# EAGLE schematic 513_lora_raspberrypi_ES920 (EAGLE 9.6.2)
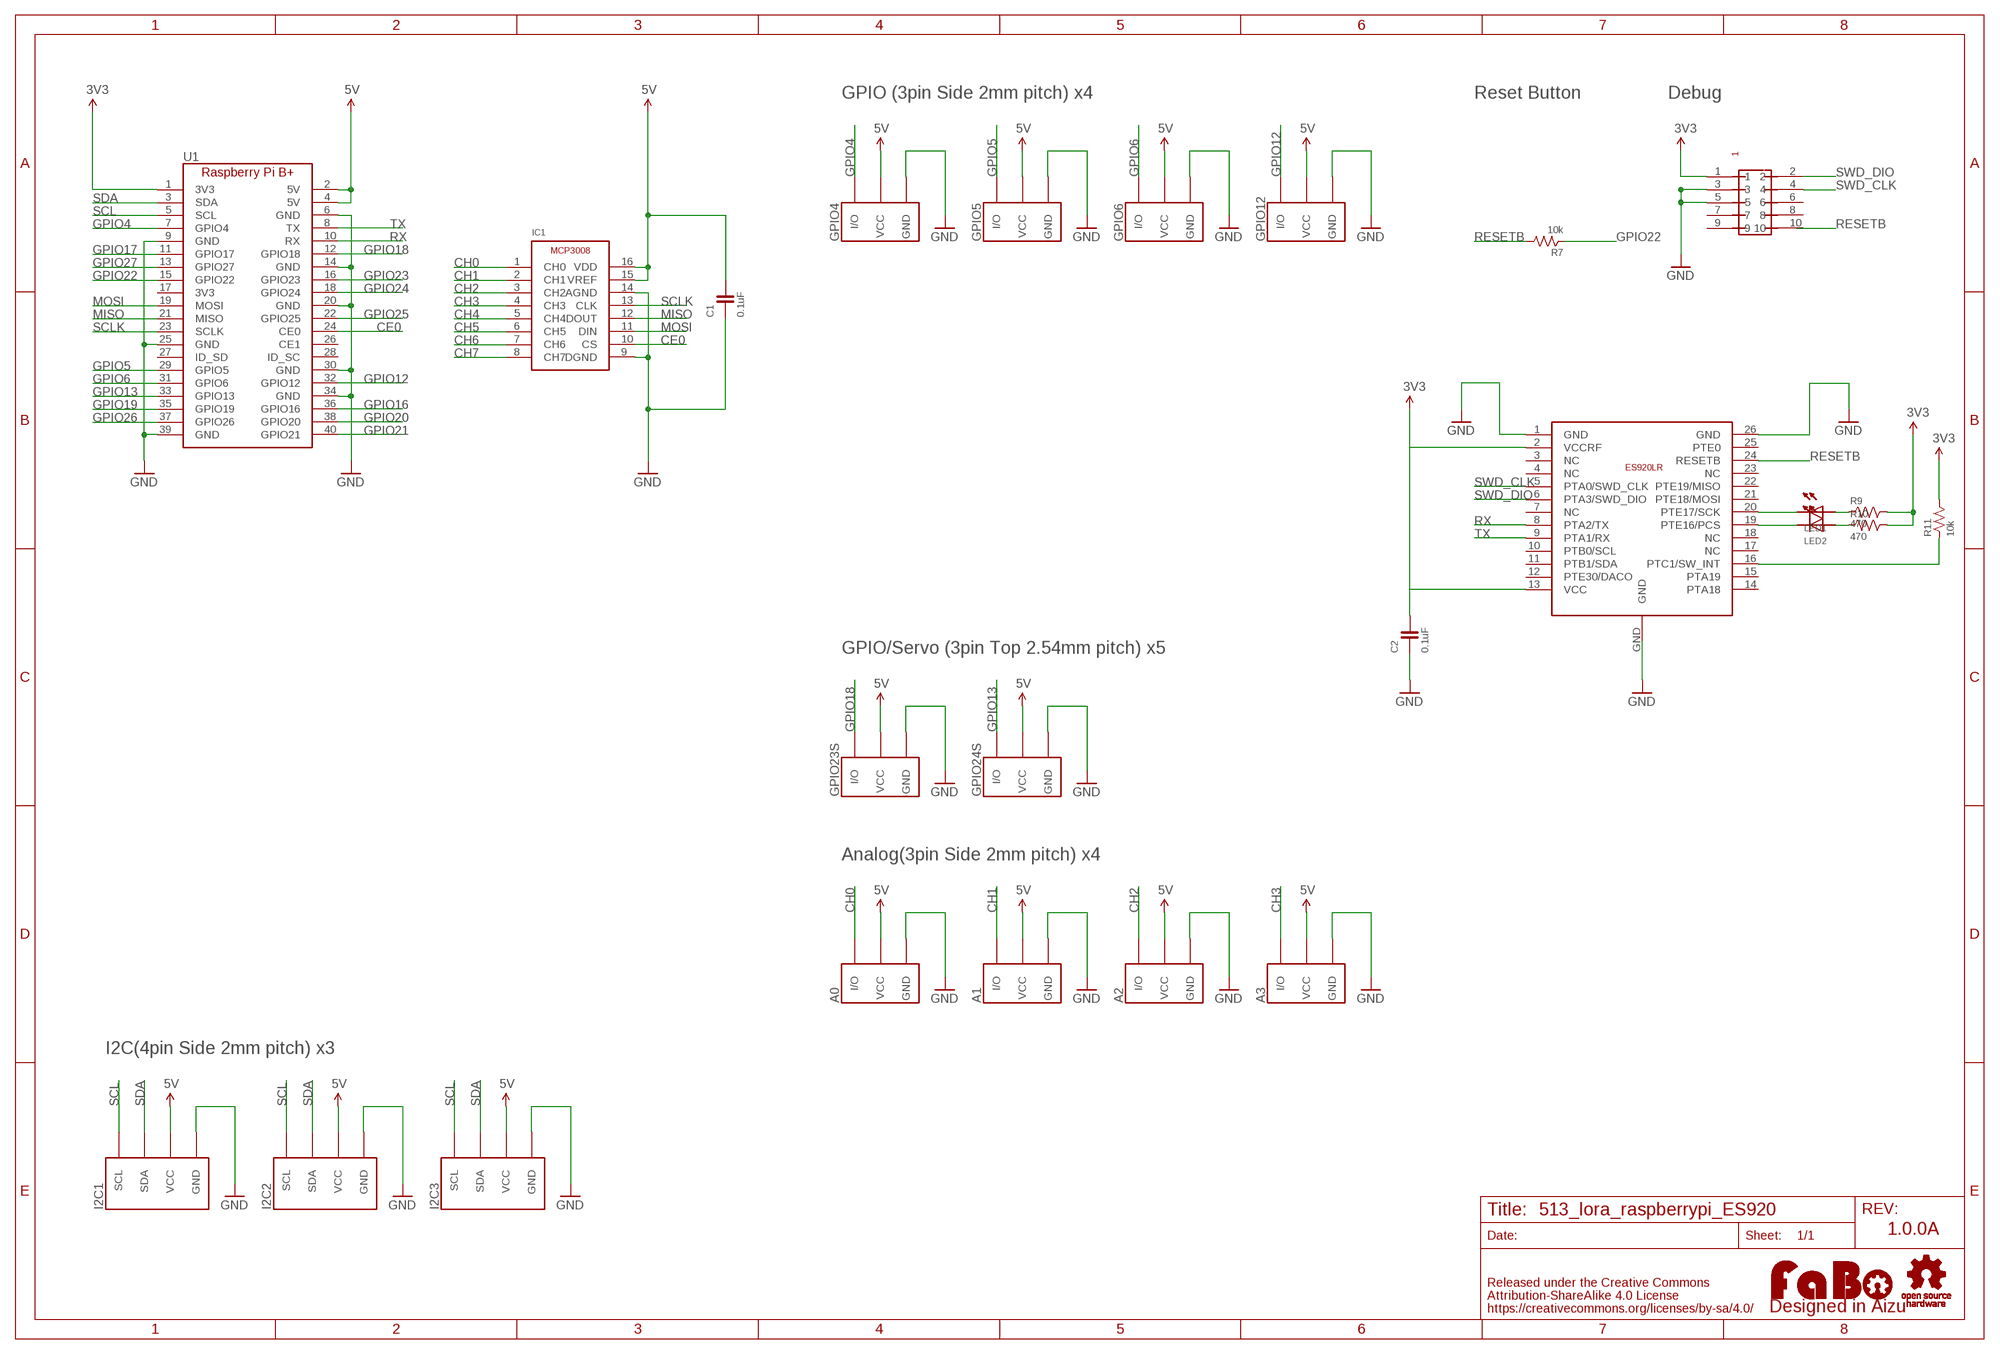
[diagram p0: schematic, sheet 1]

## Parts
A0  FABO_BRICK_3PIN-B03B-PASK-1  [FABO_BRICK_3PIN_B03B-PASK-1]
A1  FABO_BRICK_3PIN-B03B-PASK-1  [FABO_BRICK_3PIN_B03B-PASK-1]
A2  FABO_BRICK_3PIN-B03B-PASK-1  [FABO_BRICK_3PIN_B03B-PASK-1]
A3  FABO_BRICK_3PIN-B03B-PASK-1  [FABO_BRICK_3PIN_B03B-PASK-1]
C1  0.1uF  CAPACITOR-0603  [0603]
C2  0.1uF  CAPACITOR-0603_NARROW  [0603-NARROW]
GPIO4  FABO_BRICK_3PIN-S03B-PASK-2  [FABO_BRICK_3PIN_S03B-PASK-2]
GPIO5  FABO_BRICK_3PIN-S03B-PASK-2  [FABO_BRICK_3PIN_S03B-PASK-2]
GPIO6  FABO_BRICK_3PIN-S03B-PASK-2  [FABO_BRICK_3PIN_S03B-PASK-2]
GPIO12  FABO_BRICK_3PIN-S03B-PASK-2  [FABO_BRICK_3PIN_S03B-PASK-2]
GPIO23S  FABO_BRICK_3PIN-HEADER  [FABO_BRICK_3PIN_HEADER]
GPIO24S  FABO_BRICK_3PIN-HEADER  [FABO_BRICK_3PIN_HEADER]
I2C1  FABO_BRICK_I2C-S04B-PASK-2  [FABO_BRICK_I2C_S04B-PASK-2]
I2C2  FABO_BRICK_I2C-S04B-PASK-2  [FABO_BRICK_I2C_S04B-PASK-2]
I2C3  FABO_BRICK_I2C-S04B-PASK-2  [FABO_BRICK_I2C_S04B-PASK-2]
IC1  MICROCHIP-MCP3008  [MICROCHIP-MCP3008]
LED1  LED-0603  [0603]
LED2  LED-0603  [0603]
LOGO1  LOGO_FABO-M  [LOGO_FABO_M]
R7  10k  RESISTOR-0603-NARROW  [0603-NARROW]
R9  470  RESISTOR-0603-NARROW  [0603-NARROW]
R10  470  RESISTOR-0603-NARROW  [0603-NARROW]
R11  10k  RESISTOR-0603-NARROW  [0603-NARROW]
U1  RASPBERRY_PI_B+  [RASPBERRY_PI_B+]
U$3  LOGO_OSHW-M_BOTTOM  [LOGO_OSHW_M_BOTTOM]
U$15  PIN-HEADER-SMT(1.27MM)2X5  [PIN-HEADER-SMT(1.27MM)2X5]
U$16  ES920LR  [ES920LR]

## Nets
3V3: C2.2 R9.2 R10.2 R11.2 U1.1(3V3) U$15.1 U$16.2(VCCRF) U$16.13(VCC)
5V: A0.VCC A1.VCC A2.VCC A3.VCC C1.2 GPIO4.VCC GPIO5.VCC GPIO6.VCC GPIO12.VCC GPIO23S.VCC GPIO24S.VCC I2C1.VCC I2C2.VCC I2C3.VCC IC1.15(VREF) IC1.16(VDD) U1.2(5V) U1.4(5V)
CE0: IC1.10(CS) U1.24(CE0)
CH0: A0.I/O IC1.1(CH0)
CH1: A1.I/O IC1.2(CH1)
CH2: A2.I/O IC1.3(CH2)
CH3: A3.I/O IC1.4(CH3)
CH4: IC1.5(CH4)
CH5: IC1.6(CH5)
CH6: IC1.7(CH6)
CH7: IC1.8(CH7)
GND: A0.GND A1.GND A2.GND A3.GND C1.1 C2.1 GPIO4.GND GPIO5.GND GPIO6.GND GPIO12.GND GPIO23S.GND GPIO24S.GND I2C1.GND I2C2.GND I2C3.GND IC1.9(DGND) IC1.14(AGND) U1.6(GND) U1.9(GND) U1.14(GND) U1.20(GND) U1.25(GND) U1.30(GND) U1.34(GND) U1.39(GND) U$15.3 U$15.5 U$16.1(GND) U$16.26(GND) U$16.GND
GPIO4: GPIO4.I/O U1.7(GPIO4)
GPIO5: GPIO5.I/O U1.29(GPIO5)
GPIO6: GPIO6.I/O U1.31(GPIO6)
GPIO12: GPIO12.I/O U1.32(GPIO12)
GPIO13: GPIO24S.I/O U1.33(GPIO13)
GPIO16: U1.36(GPIO16)
GPIO17: U1.11(GPIO17)
GPIO18: GPIO23S.I/O U1.12(GPIO18)
GPIO19: U1.35(GPIO19)
GPIO20: U1.38(GPIO20)
GPIO21: U1.40(GPIO21)
GPIO22: R7.1 U1.15(GPIO22)
GPIO23: U1.16(GPIO23)
GPIO24: U1.18(GPIO24)
GPIO25: U1.22(GPIO25)
GPIO26: U1.37(GPIO26)
GPIO27: U1.13(GPIO27)
MISO: IC1.12(DOUT) U1.21(MISO)
MOSI: IC1.11(DIN) U1.19(MOSI)
N$4: LED2.CATHODE U$16.19(PTE16/PCS)
N$5: LED1.CATHODE U$16.20(PTE17/SCK)
N$6: LED1.ANODE R9.1
N$7: LED2.ANODE R10.1
N$8: R11.1 U$16.16(PTC1/SW_INT)
RESETB: R7.2 U$15.10 U$16.24(RESETB)
RX: U1.10(RX) U$16.8(PTA2/TX)
SCL: I2C1.SCL I2C2.SCL I2C3.SCL U1.5(SCL)
SCLK: IC1.13(CLK) U1.23(SCLK)
SDA: I2C1.SDA I2C2.SDA I2C3.SDA U1.3(SDA)
SWD_CLK: U$15.4 U$16.5(PTA0/SWD_CLK)
SWD_DIO: U$15.2 U$16.6(PTA3/SWD_DIO)
TX: U1.8(TX) U$16.9(PTA1/RX)
Unconnected: U1.17(3V3) U1.26(CE1) U1.27(ID_SD) U1.28(ID_SC) U$15.6 U$15.7 U$15.8 U$15.9 U$16.3(NC) U$16.4(NC) U$16.7(NC) U$16.10(PTB0/SCL) U$16.11(PTB1/SDA) U$16.12(PTE30/DACO) U$16.14(PTA18) U$16.15(PTA19) U$16.17(NC) U$16.18(NC) U$16.21(PTE18/MOSI) U$16.22(PTE19/MISO) U$16.23(NC) U$16.25(PTE0)

## Notes on the sheet
- GPIO (3pin Side 2mm pitch) x4 | Reset Button | Debug
- GPIO/Servo (3pin Top 2.54mm pitch) x5
- Analog(3pin Side 2mm pitch) x4
- I2C(4pin Side 2mm pitch) x3
- 1.0.0A

## Library data of the parts
A0 A1-A3 GPIO4-GPIO6 GPIO12 GPIO23S GPIO24S = FaBo-Template:FABO_BRICK_3PIN: FaBo Brick 3pin
C1 C2 = FaBo-Capacitor:CAPACITOR: CAPACITOR
I2C1-I2C3 = FaBo-Template:FABO_BRICK_I2C: FaBo Brick I2C
IC1 = FaBo-ADC:MICROCHIP-MCP3008
LED1 LED2 = FaBo-LED:LED
LOGO1 = component:LOGO_FABO
R7 R9-R11 = FaBo-Resistors:RESISTOR: RESISTOR
U1 = FaBo-Boards:RASPBERRY_PI_B+
U$3 = component:LOGO_OSHW
U$15 = GClue:PIN-HEADER-SMT(1.27MM)2X5: PIN-HEADER-SMT (1.27MM) 2x5
U$16 = FaBo-LoRa:ES920LR